# Altium schematic sheet Archived.SchDoc
size A4; SheetNumber: 4; SheetTotal: 4
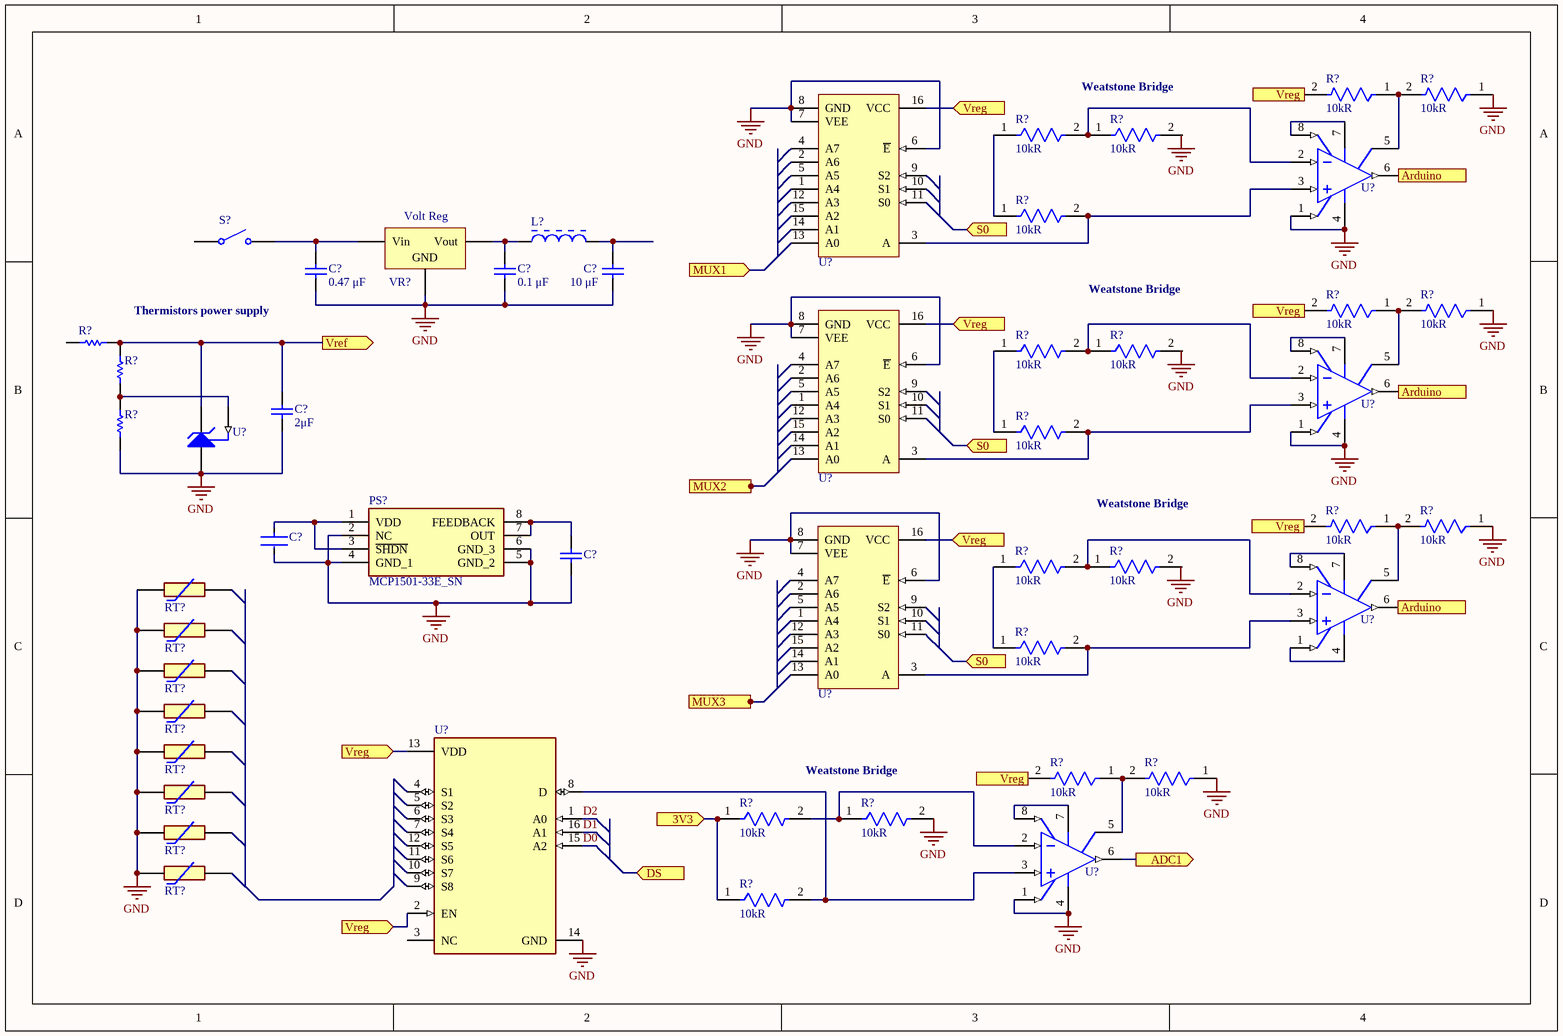
[diagram p0: Archived.SchDoc]

## Parts
(Parts that share a designator on the sheet are numbered #1, #2 ... from top to bottom, then left to right.)
C?#1  value 0.47 μF  (hidden comment: Capacitor)
C?#2  value 0.1 μF  (hidden comment: Capacitor)
C?#3  value 10 μF  (hidden comment: Capacitor)
C?#4  value 2μF  (hidden comment: Capacitor)
C?#5  CL10A225KO8NNNC  [FP-CL10-IPC_A]  (value not drawn)
C?#6  VJ0402Y102JXXCW1BC  [CAPC1005X55X25NL05T05]  (value not drawn)
L?  BL01RN1A1D2B  [INDA65-500X360]  (value not drawn)
PS?  MCP1501-33E_SN  [SOIC127P600X175-8N]
R?#1  value 10kR  [FP-RT0603-IPC_C]  (hidden comment: RT0603BRD0710KL)
R?#2  value 10kR  [FP-RT0603-IPC_C]  (hidden comment: RT0603BRD0710KL)
R?#3  value 10kR  [FP-RT0603-IPC_C]  (hidden comment: RT0603BRD0710KL)
R?#4  value 10kR  [FP-RT0603-IPC_C]  (hidden comment: RT0603BRD0710KL)
R?#5  value 10kR  [FP-RT0603-IPC_C]  (hidden comment: RT0603BRD0710KL)
R?#6  value 10kR  [FP-RT0603-IPC_C]  (hidden comment: RT0603BRD0710KL)
R?#7  value 10kR  [FP-RT0603-IPC_C]  (hidden comment: RT0603BRD0710KL)
R?#8  Resistor  (value not drawn)
R?#9  value 10kR  [FP-RT0603-IPC_C]  (hidden comment: RT0603BRD0710KL)
R?#10  value 10kR  [FP-RT0603-IPC_C]  (hidden comment: RT0603BRD0710KL)
R?#11  Resistor  (value not drawn)
R?#12  value 10kR  [FP-RT0603-IPC_C]  (hidden comment: RT0603BRD0710KL)
R?#13  Resistor  (value not drawn)
R?#14  value 10kR  [FP-RT0603-IPC_C]  (hidden comment: RT0603BRD0710KL)
R?#15  value 10kR  [FP-RT0603-IPC_C]  (hidden comment: RT0603BRD0710KL)
R?#16  value 10kR  [FP-RT0603-IPC_C]  (hidden comment: RT0603BRD0710KL)
R?#17  value 10kR  [FP-RT0603-IPC_C]  (hidden comment: RT0603BRD0710KL)
R?#18  value 10kR  [FP-RT0603-IPC_C]  (hidden comment: RT0603BRD0710KL)
R?#19  value 10kR  [FP-RT0603-IPC_C]  (hidden comment: RT0603BRD0710KL)
R?#20  value 10kR  [FP-RT0603-IPC_C]  (hidden comment: RT0603BRD0710KL)
R?#21  value 10kR  [FP-RT0603-IPC_C]  (hidden comment: RT0603BRD0710KL)
R?#22  value 10kR  [FP-RT0603-IPC_C]  (hidden comment: RT0603BRD0710KL)
R?#23  value 10kR  [FP-RT0603-IPC_C]  (hidden comment: RT0603BRD0710KL)
RT?#1  NTCLE350E4103FHB0  [NTCLE350E4103FHB0]  (value not drawn)
RT?#2  NTCLE350E4103FHB0  [NTCLE350E4103FHB0]  (value not drawn)
RT?#3  NTCLE350E4103FHB0  [NTCLE350E4103FHB0]  (value not drawn)
RT?#4  NTCLE350E4103FHB0  [NTCLE350E4103FHB0]  (value not drawn)
RT?#5  NTCLE350E4103FHB0  [NTCLE350E4103FHB0]  (value not drawn)
RT?#6  NTCLE350E4103FHB0  [NTCLE350E4103FHB0]  (value not drawn)
RT?#7  NTCLE350E4103FHB0  [NTCLE350E4103FHB0]  (value not drawn)
RT?#8  NTCLE350E4103FHB0  [NTCLE350E4103FHB0]  (value not drawn)
S?  Single-Pole, Single-Throw Switch  (value not drawn)
U?#1  MCP6N11-100E/SN  [SOIC-SN8_L]  (value not drawn)
U?#2  CD74HC4051M96  [D0016A_M]  (value not drawn)
U?#3  MCP6N11-100E/SN  [SOIC-SN8_L]  (value not drawn)
U?#4  TL431AILPR  [LP0003A]  (value not drawn)
U?#5  CD74HC4051M96  [D0016A_M]  (value not drawn)
U?#6  MCP6N11-100E/SN  [SOIC-SN8_L]  (value not drawn)
U?#7  CD74HC4051M96  [D0016A_M]  (value not drawn)
U?#8  TMUX1208PWR  [FP-PW0016A-IPC_B]  (value not drawn)
U?#9  MCP6N11-100E/SN  [SOIC-SN8_L]  (value not drawn)
VR?  Volt Reg  [D2PAK_N]

## Ports
3V3 (in), ADC1 (out), Arduino (out, see Weatstone bridges part I[3A], Weatstone bridges part I[3B], Weatstone bridges part I[3D]), Arduino (out, see Weatstone bridges part I[3A], Weatstone bridges part I[3C], Weatstone bridges part I[3D]), Arduino (out, see Weatstone bridges part I[3B], Weatstone bridges part I[3C], Weatstone bridges part I[3D]), DS (in), MUX1 (in, see Thermistors[1A]), MUX2 (in, see Thermistors[2A]), MUX3 (in, see Thermistors[3A]), S0 (in, see Weatstone bridges part I[2A], Weatstone bridges part I[2B], Weatstone bridges part I[2D]), S0 (in, see Weatstone bridges part I[2A], Weatstone bridges part I[2C], Weatstone bridges part I[2D]), S0 (in, see Weatstone bridges part I[2B], Weatstone bridges part I[2C], Weatstone bridges part I[2D]), Vref (out, see Power Supply Unit[4B], Thermistors[1B]), Vreg (in), Vreg (in, see Power Supply Unit[3B], Processing interface[1A], Processing interface[1B], Processing interface[1C], Processing interface[3C], Processing interface[4A], Processing interface[4B], Processing interface[4C], Processing interface[4D], Weatstone bridges part I[2A], Weatstone bridges part I[2B], Weatstone bridges part I[2C], Weatstone bridges part I[3A], Weatstone bridges part I[3B], Weatstone bridges part I[3C], Weatstone bridges part II[2B], Weatstone bridges part II[2C], Weatstone bridges part II[3B]), Vreg (in, see Power Supply Unit[3B], Processing interface[1A], Processing interface[1B], Processing interface[1C], Processing interface[3C], Processing interface[4A], Processing interface[4B], Processing interface[4C], Processing interface[4D], Weatstone bridges part I[2A], Weatstone bridges part I[2B], Weatstone bridges part I[2C], Weatstone bridges part I[3B], Weatstone bridges part I[3C], Weatstone bridges part II[2B], Weatstone bridges part II[2C], Weatstone bridges part II[3B]), Vreg (in, see Power Supply Unit[3B], Processing interface[1A], Processing interface[1B], Processing interface[1C], Processing interface[3C], Processing interface[4A], Processing interface[4B], Processing interface[4C], Processing interface[4D], Weatstone bridges part I[2B], Weatstone bridges part I[2C], Weatstone bridges part I[3A], Weatstone bridges part I[3B], Weatstone bridges part I[3C], Weatstone bridges part II[2B], Weatstone bridges part II[2C], Weatstone bridges part II[3B])

## Nets
GND: C?#1.1 C?#2.1 C?#3.1 C?#4.1 C?#5.2 C?#6.1 PS?.2(NC) PS?.4(GND_1) PS?.5(GND_2) PS?.6(GND_3) R?#2.1 R?#7.1 R?#13.1 R?#15.1 R?#20.1 R?#22.2 RT?#1.1 RT?#2.1 RT?#3.1 RT?#4.1 RT?#5.1 RT?#6.1 RT?#7.1 RT?#8.1 U?#1.1(VFG) U?#1.4(VSS) U?#2.6(~{E}) U?#2.7(VEE) U?#2.8(GND) U?#3.1(VFG) U?#3.4(VSS) U?#4.2(ANODE) U?#5.6(~{E}) U?#5.7(VEE) U?#5.8(GND) U?#7.6(~{E}) U?#7.7(VEE) U?#7.8(GND) U?#8.14(GND) U?#9.1(VFG) U?#9.4(VSS) VR?.2(GND)
3V3: R?#21.1 R?#23.1 ; port 3V3
ADC1: U?#9.6(VOUT) ; port ADC1
Arduino: U?#1.6(VOUT) U?#3.6(VOUT) U?#6.6(VOUT) ; port Arduino
D0: U?#8.15(A2)
D1: U?#8.16(A1)
D2: U?#8.1(A0)
Vref: C?#4.2 R?#8.1 R?#11.2 U?#4.3(CATHODE) ; port Vref
Vreg: R?#1.2 R?#6.2 R?#14.2 R?#19.2 U?#2.16(VCC) U?#5.16(VCC) U?#7.16(VCC) U?#8.2(EN) U?#8.13(VDD) ; port Vreg
NetC?#1_2: C?#1.2 S?.2 VR?.1(Vin)
NetC?#2_2: C?#2.2 L?.1 VR?.3(Vout)
NetC?#3_2: C?#3.2 L?.2
NetC?#5_1: C?#5.1 PS?.1(VDD) PS?.3(~{SHDN})
NetC?#6_2: C?#6.2 PS?.7(OUT) PS?.8(FEEDBACK)
NetR?#1_1: R?#1.1 R?#2.2 U?#1.5(VREF)
NetR?#3_1: R?#3.1 R?#5.1
NetR?#3_2: R?#3.2 R?#4.1 U?#1.2(VIM)
NetR?#5_2: R?#5.2 U?#1.3(VIP) U?#2.3(A)
NetR?#6_1: R?#6.1 R?#7.2 U?#3.5(VREF)
NetR?#9_1: R?#9.1 R?#12.1
NetR?#9_2: R?#9.2 R?#10.1 U?#3.2(VIM)
NetR?#11_1: R?#11.1 R?#13.2 U?#4.1(REF)
NetR?#12_2: R?#12.2 U?#3.3(VIP) U?#5.3(A)
NetR?#14_1: R?#14.1 R?#15.2 U?#6.5(VREF)
NetR?#16_1: R?#16.1 R?#18.1
NetR?#16_2: R?#16.2 R?#17.1 U?#6.2(VIM)
NetR?#18_2: R?#18.2 U?#6.3(VIP) U?#7.3(A)
NetR?#19_1: R?#19.1 R?#20.2 U?#9.5(VREF)
NetR?#21_2: R?#21.2 R?#22.1 U?#9.2(VIM)
NetR?#23_2: R?#23.2 U?#8.8(D) U?#9.3(VIP)
NetU?#1_7: U?#1.7(VDD) U?#1.8(EN/~{CAL})
NetU?#3_7: U?#3.7(VDD) U?#3.8(EN/~{CAL})
NetU?#6_1: U?#6.1(VFG) U?#6.4(VSS)
NetU?#6_7: U?#6.7(VDD) U?#6.8(EN/~{CAL})
NetU?#9_7: U?#9.7(VDD) U?#9.8(EN/~{CAL})

Not connected (* = marked no-connect by the designer): R?#4 2; R?#8 2; R?#10 2; R?#17 2; RT?#1 2; RT?#2 2; RT?#3 2; RT?#4 2; RT?#5 2; RT?#6 2; RT?#7 2; RT?#8 2; S? 1; U?#2 1(A4) 2(A6) 4(A7) 5(A5) 9(S2) 10(S1) 11(S0) 12(A3) 13(A0) 14(A1) 15(A2); U?#5 1(A4) 2(A6) 4(A7) 5(A5) 9(S2) 10(S1) 11(S0) 12(A3) 13(A0) 14(A1) 15(A2); U?#7 1(A4) 2(A6) 4(A7) 5(A5) 9(S2) 10(S1) 11(S0) 12(A3) 13(A0) 14(A1) 15(A2); U?#8 3(NC) 4(S1) 5(S2) 6(S3) 7(S4) 9(S8) 10(S7) 11(S6) 12(S5)

## Notes on the sheet
- (near R?#4) Weatstone Bridge
- (near R?#8) Thermistors power supply
- Weatstone Bridge
- (near R?#22) Weatstone Bridge
- Labels drawn without touching a wire or pin: GND

## Library data of the parts
C?#1-C?#4 = Capacitor: SimulationGenericComponent: True
C?#5 = CMP-13271-000835-1: Cap Ceramic 2.2uF 16V X5R ±10% Pad SMD 0603 +85°C T/R; Case Code (Metric): 1608; Height: 0.8mm; Case/Package: 0603; Depth: 0.8mm; Capacitance: 2.2uF; Voltage Rating: 16V; Case Code (Imperial): 0603; Length: 1.6mm; Packaging: Tape and Reel; Material: Ceramic; Lead Free: Lead Free; Max Operating Temperature: 85°C; Contact Plating: Tin; Thickness: 0.035inch; Radiation Hardening: No; Tolerance: 10%; Min Operating Temperature: -55°C; Voltage: 16V; Dielectric: X5R; Mount: Surface Mount; Package Quantity: 4000; Width: 0.031inch; Voltage Rating (DC): 16V
C?#6 = CMP-2008-01349-1: Manufacturer: Vitramon; Part Number: VJ0402Y102JXXCW1BC
L? = CMP-006-00003-3: EMI Suppression Filter (Lead Type EMIFIL(R)), 7 A, -40 to 85 degC, 2-Pin THD, RoHS, Bulk; Manufacturer: Murata; Impedance: 50Ohm; Current Rating: 7A; Core Material: Ferrite; Packaging: Bulk; Package Reference: INDA65-500X360; Case/Package: Axial; Datasheet URL: http://www.murata.com/en-us/products/productdata/8796738977822/ENFA0005.pdf; Package Quantity: 500; Diameter: 3.6mm; Datasheet Version: May-16; Min Operating Temperature: -40°C; Mounting Technology: TH; RoHS Compliant: True; Package Description: 2-Pin Axial Lead, Dia 3.6 mm, Body Length 5 mm; Max Operating Temperature: 85°C; Pins: 2; Max Current Rating: 7A
PS? = MCP1501-33E_SN: Power Supply; Manufacturer_Name: Microchip; Manufacturer_Part_Number: MCP1501-33E/SN; Datasheet Link: http://www.farnell.com/datasheets/2158574.pdf; Height: 1.75mm; Mouser Part Number: 579-MCP1501-33E/SN; Mouser Price/Stock: https://www.mouser.co.uk/ProductDetail/Microchip-Technology-Atmel/MCP1501-33E-SN?qs=BA62vJVifGoOZffNI8tq9A%3D%3D; Arrow Part Number: MCP1501-33E/SN; Arrow Price/Stock: https://www.arrow.com/en/products/mcp1501-33esn/microchip-technology?region=nac
R?#1-R?#7 R?#9 R?#10 R?#12 R?#14-R?#23 = CMP-009-00178-1: Res High precision Thin Film 0603 10K Ohm 0.1% 1/10W ±25ppm/°C Molded SMD Paper T/R; Max Power Dissipation: 100mW; Working Voltage: 75V; RoHS Compliant: Yes; Power Rating: 100mW; Lead Free: Lead Free; Depth: 0.8mm; Case Code (Imperial): 0603; Max Operating Temperature: 155°C; Voltage Rating: 75V; Package Quantity: 5000; Packaging: Tape and Reel; Case/Package: 0603; Height: 0.022inch; Construction: Rectangular; Min Operating Temperature: -55°C; Termination: SMD/SMT; Features: Moisture Resistant; Number of Terminations: 2; Case Code (Metric): 1608; Technology: THIN FILM; Military Standard: Not; Length: 0.063inch; Voltage Rating (DC): 75V; Temperature Coefficient: 25ppm/°C; Weight: 7.1E-05oz; Width: 0.8mm; Series: RT; Resistor Type: Thin Film
R?#8 R?#11 R?#13 = Resistor: TC1: 0; SimulationGenericComponent: True; Value: 1K; TC2: 0
RT?#1-RT?#8 = NTCLE350E4103FHB0: Thermistor; Manufacturer_Name: Vishay; Datasheet Link: https://www.vishay.com/docs/29218/ntcle350e4.pdf; Height: 7mm; Manufacturer_Part_Number: NTCLE350E4103FHB0
S? = SPST SW: closed: 0; Rclosed: 1m; Ropen: 1Meg; SimulationGenericComponent: True
U?#1 U?#3 U?#6 U?#9 = CMP-014-00010-1: MCP6N11 Series Single Channel 500 KHz 5.5 V Instrumentation Amplifier - SOIC-8; Bandwidth: 500kHz; Min Supply Voltage: 1.8V; Number of Elements: 2; Gain Bandwidth Product: 35MHz; Input Offset Voltage (Vos): 350uV; Number of Channels: 1; Nominal Supply Current: 800uA; Common Mode Rejection Ratio: 86dB; Slew Rate: 6V/µs; Max Supply Voltage: 5.5V; Slew Rate-Nom: 9V/µs; Input Bias Current: 10pA; Mounting Technology: Surface Mount; Package Quantity: 100; Pins: 8; Width: 3.9mm; Length: 4.9mm; Case/Package: SOIC; Min Operating Temperature: -40°C; Radiation Hardening: No; RoHS Compliant: Yes; Unity Gain Bandwidth Product: 35MHz; Lead Free: Lead Free; Number of Amplifiers: 1; Max Operating Temperature: 125°C; Height: 1.25mm; Packaging: Rail/Tube; Input Offset Voltage-Max: 350uV; Reach SVHC Compliant: Yes; Supply Current: 800uA; Max Supply Current: 800uA; Power Supply Rejection Ratio (PSRR): 86dB; Number of Circuits: 1
U?#2 U?#5 U?#7 = CMP-1575-00036-4: High Speed CMOS 8-Channel Analog Multiplexer/Demultiplexer, D0016A, LARGE T&R; Manufacturer: Texas Instruments; Crosstalk: Yes; Ron(Max)(Ohms): 130; VCC(Min)(V): 2; Bandwidth(Max)(MHz): 180; VCC(Max)(V): 6; Rating: Catalog; Configuration: 1 X 1：8 MUX; Ron(Typ)(Ohms): 45; Generic Part Number: CD74HC4051; Output Type: CMOS; Operating Temperature Range(C): -55 to 125; DatasheetVersion: SCHS122J; Code_JEDEC: MS-012 variation AC; PackageReference: D0016A; PackageVersion: http://www.ti.com/lit/ml/mpds178g/mpds178g.pdf
U?#4 = CMP-019-00054-1: IC VREF SHUNT ADJ TO92-3; Max Output Voltage: 36V; Cathode Current: 700uA; Max Output current: 100mA; Min Input Voltage: 2.495V; Temperature Coefficient: 92ppm/°C; Max Supply Voltage: 37V; Reference Type: Shunt,Adjustable; Tolerance: 1%; Number of Channels: 1; Max Operating Temperature: 125°C; Reach SVHC Compliant: Yes; Weight: 0.00752oz; Case/Package: TO-92-3; RoHS Compliant: Yes; Packaging: Tape and Reel; Lead Free: Lead Free; Package Quantity: 1; Output Voltage: 36V; Output Current: 100mA; Series: -; Reference Voltage: 36V; Min Operating Temperature: -40°C; Pins: 3
U?#8 = CMP-015-00012-1: 5-V, 8: 1, 1-channel general-purpose analog multiplexer with 1.8-V input logic 16-TSSOP -40 to 125; RoHS Compliant: Yes
VR? = Volt Reg: Voltage Regulator; Published: 24-Mar-1999; LatestRevisionDate: 29-May-2009; LatestRevisionNote: IPC-7351 Footprint Added.; PackageReference: D2PAK; Publisher: Altium Limited; PackageDescription: 3-Pin Transistor Outline Package 2.54 mm Pitch, 15.1 mm Lead Span